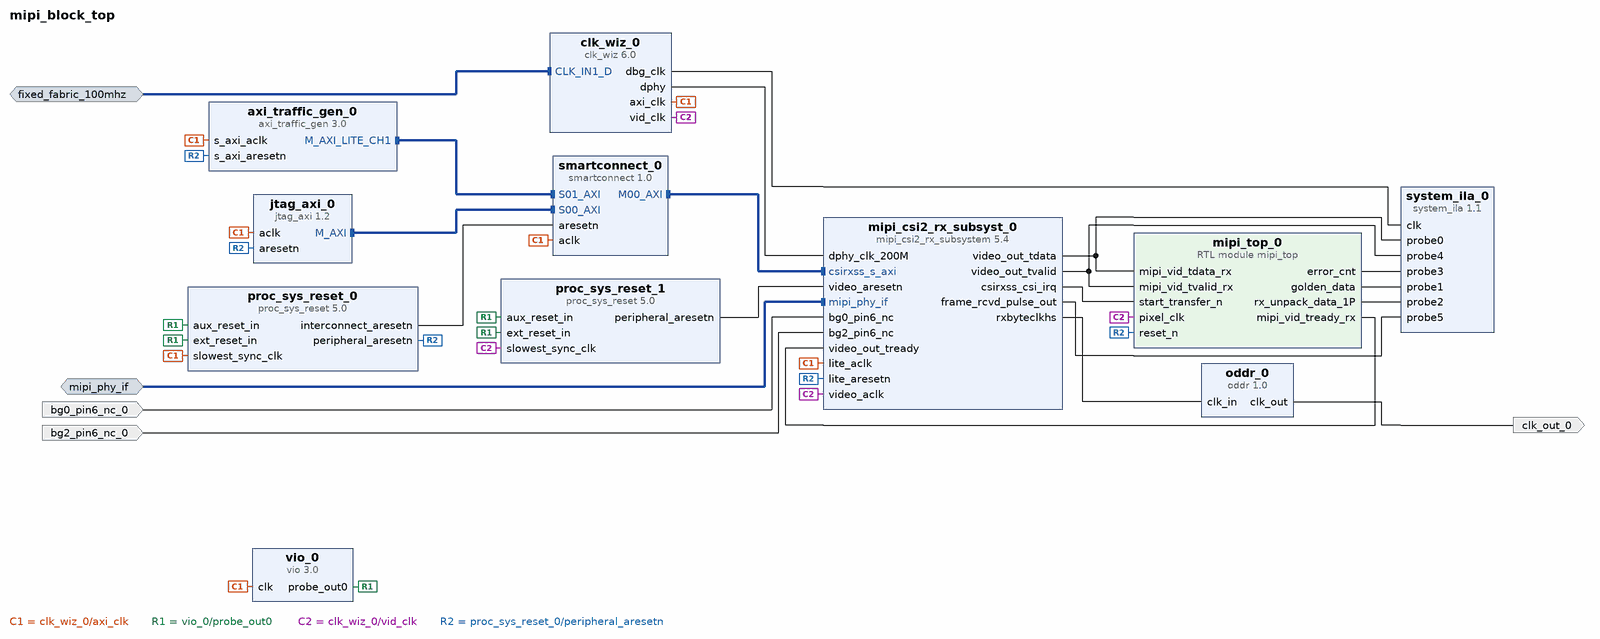
[diagram p0: block diagram of the top level]
# Vivado block design mipi_block_top, xcau25p-ffvb676-2-e, Vivado 2023.2_AR000035847
create_bd_design mipi_block_top

create_bd_intf_port -mode Slave -vlnv xilinx.com:interface:diff_clock_rtl:1.0 fixed_fabric_100mhz
set_property -dict {CONFIG.FREQ_HZ 100000000} [get_bd_intf_ports fixed_fabric_100mhz]
create_bd_intf_port -mode Slave -vlnv xilinx.com:interface:mipi_phy_rtl:1.0 mipi_phy_if
create_bd_port -dir I bg0_pin6_nc_0
create_bd_port -dir I bg2_pin6_nc_0
create_bd_port -dir O -type clk clk_out_0

create_bd_cell -type ip -vlnv xilinx.com:ip:clk_wiz:6.0 clk_wiz_0
set_property -dict [list \
  CONFIG.CLKOUT1_JITTER 85.182 \
  CONFIG.CLKOUT1_PHASE_ERROR 76.967 \
  CONFIG.CLKOUT1_REQUESTED_OUT_FREQ 200 \
  CONFIG.CLKOUT2_JITTER 79.341 \
  CONFIG.CLKOUT2_PHASE_ERROR 76.967 \
  CONFIG.CLKOUT2_REQUESTED_OUT_FREQ 300 \
  CONFIG.CLKOUT2_USED true \
  CONFIG.CLKOUT3_JITTER 72.605 \
  CONFIG.CLKOUT3_PHASE_ERROR 76.967 \
  CONFIG.CLKOUT3_REQUESTED_OUT_FREQ 500 \
  CONFIG.CLKOUT3_USED true \
  CONFIG.CLKOUT4_JITTER 72.605 \
  CONFIG.CLKOUT4_PHASE_ERROR 76.967 \
  CONFIG.CLKOUT4_REQUESTED_OUT_FREQ 500 \
  CONFIG.CLKOUT4_USED true \
  CONFIG.CLK_IN1_BOARD_INTERFACE fixed_fabric_100mhz \
  CONFIG.CLK_OUT1_PORT dphy \
  CONFIG.CLK_OUT2_PORT axi_clk \
  CONFIG.CLK_OUT3_PORT vid_clk \
  CONFIG.CLK_OUT4_PORT dbg_clk \
  CONFIG.MMCM_CLKFBOUT_MULT_F 15.000 \
  CONFIG.MMCM_CLKIN1_PERIOD 10.000 \
  CONFIG.MMCM_CLKIN2_PERIOD 10.000 \
  CONFIG.MMCM_CLKOUT0_DIVIDE_F 7.500 \
  CONFIG.MMCM_CLKOUT1_DIVIDE 5 \
  CONFIG.MMCM_CLKOUT2_DIVIDE 3 \
  CONFIG.MMCM_CLKOUT3_DIVIDE 3 \
  CONFIG.NUM_OUT_CLKS 4 \
  CONFIG.PRIM_SOURCE Differential_clock_capable_pin \
  CONFIG.RESET_PORT reset \
  CONFIG.RESET_TYPE ACTIVE_HIGH \
  CONFIG.USE_BOARD_FLOW true \
  CONFIG.USE_LOCKED false \
  CONFIG.USE_RESET false \
] [get_bd_cells clk_wiz_0]
create_bd_cell -type ip -vlnv xilinx.com:ip:mipi_csi2_rx_subsystem:5.4 mipi_csi2_rx_subsyst_0
set_property -dict [list \
  CONFIG.CLK_LANE_IO_LOC F20 \
  CONFIG.CMN_INC_VFB true \
  CONFIG.CMN_NUM_LANES 4 \
  CONFIG.CMN_NUM_PIXELS 1 \
  CONFIG.CMN_PXL_FORMAT RGB888 \
  CONFIG.CSI_BUF_DEPTH 4096 \
  CONFIG.CSI_EMB_NON_IMG false \
  CONFIG.C_CLK_LANE_IO_POSITION 19 \
  CONFIG.C_CSI_EN_CRC true \
  CONFIG.C_CSI_FILTER_USERDATATYPE false \
  CONFIG.C_DATA_LANE0_IO_POSITION 13 \
  CONFIG.C_DATA_LANE1_IO_POSITION 26 \
  CONFIG.C_DATA_LANE2_IO_POSITION 2 \
  CONFIG.C_DATA_LANE3_IO_POSITION 15 \
  CONFIG.C_DPHY_LANES 4 \
  CONFIG.C_EN_BG0_PIN6 true \
  CONFIG.C_EN_BG2_PIN6 true \
  CONFIG.C_EN_CNTS_BYTE_CLK true \
  CONFIG.C_EN_CSI_V2_0 false \
  CONFIG.C_EN_TIMEOUT_REGS false \
  CONFIG.C_HS_SETTLE_NS 139 \
  CONFIG.C_RCVE_DESKEW_SEQ false \
  CONFIG.DATA_LANE0_IO_LOC H18 \
  CONFIG.DATA_LANE1_IO_LOC C18 \
  CONFIG.DATA_LANE2_IO_LOC H17 \
  CONFIG.DATA_LANE3_IO_LOC F18 \
  CONFIG.DPY_EN_REG_IF true \
  CONFIG.DPY_LINE_RATE 2500 \
  CONFIG.HP_IO_BANK_SELECTION 67 \
  CONFIG.SupportLevel 1 \
  CONFIG.VFB_TU_WIDTH 96 \
] [get_bd_cells mipi_csi2_rx_subsyst_0]
create_bd_cell -type ip -vlnv xilinx.com:ip:proc_sys_reset:5.0 proc_sys_reset_0
set_property -dict {CONFIG.C_EXT_RST_WIDTH 1} [get_bd_cells proc_sys_reset_0]
create_bd_cell -type ip -vlnv xilinx.com:ip:proc_sys_reset:5.0 proc_sys_reset_1
create_bd_cell -type ip -vlnv xilinx.com:ip:jtag_axi:1.2 jtag_axi_0
set_property -dict {CONFIG.PROTOCOL 2} [get_bd_cells jtag_axi_0]
create_bd_cell -type ip -vlnv xilinx.com:ip:axi_traffic_gen:3.0 axi_traffic_gen_0
set_property -dict [list \
  CONFIG.C_ATG_MIF_DATA_DEPTH 256 \
  CONFIG.C_ATG_MODE AXI4-Lite \
  CONFIG.C_ATG_SYSTEM_CH1_HIGH 0x44a2ffff \
  CONFIG.C_ATG_SYSTEM_CH1_LOW 0x44a00000 \
  CONFIG.C_ATG_SYSTEM_INIT_ADDR_MIF ../mipi_block_top_axi_traffic_gen_0_0.coe \
  CONFIG.C_ATG_SYSTEM_INIT_DATA_MIF ../mipi_block_top_axi_traffic_gen_data.coe \
  CONFIG.C_ATG_SYSTEM_TEST_MAX_CLKS 50000 \
] [get_bd_cells axi_traffic_gen_0]
create_bd_cell -type ip -vlnv xilinx.com:ip:smartconnect:1.0 smartconnect_0
set_property -dict {CONFIG.NUM_MI 1} [get_bd_cells smartconnect_0]
create_bd_cell -type ip -vlnv xilinx.com:ip:vio:3.0 vio_0
set_property -dict {CONFIG.C_NUM_PROBE_IN 0 CONFIG.C_PROBE_OUT0_INIT_VAL 0x1} [get_bd_cells vio_0]
create_bd_cell -type ip -vlnv xilinx.com:ip:system_ila:1.1 system_ila_0
set_property -dict [list \
  CONFIG.C_DATA_DEPTH 8192 \
  CONFIG.C_MON_TYPE NATIVE \
  CONFIG.C_NUM_OF_PROBES 6 \
  CONFIG.C_PROBE0_TYPE 0 \
  CONFIG.C_PROBE1_TYPE 0 \
  CONFIG.C_PROBE2_TYPE 0 \
  CONFIG.C_PROBE3_TYPE 0 \
  CONFIG.C_PROBE4_TYPE 0 \
  CONFIG.C_PROBE5_TYPE 0 \
  CONFIG.C_PROBE_WIDTH_PROPAGATION AUTO \
] [get_bd_cells system_ila_0]
create_bd_cell -type ip -vlnv xilinx.com:ip:oddr:1.0 oddr_0
create_bd_cell -type module -reference mipi_top mipi_top_0

# ---- connections ----

connect_bd_intf_net [get_bd_intf_pins axi_traffic_gen_0/M_AXI_LITE_CH1] [get_bd_intf_pins smartconnect_0/S01_AXI]
connect_bd_intf_net [get_bd_intf_ports fixed_fabric_100mhz] [get_bd_intf_pins clk_wiz_0/CLK_IN1_D]
connect_bd_intf_net [get_bd_intf_pins jtag_axi_0/M_AXI] [get_bd_intf_pins smartconnect_0/S00_AXI]
connect_bd_intf_net [get_bd_intf_pins mipi_csi2_rx_subsyst_0/mipi_phy_if] [get_bd_intf_ports mipi_phy_if]
connect_bd_intf_net [get_bd_intf_pins smartconnect_0/M00_AXI] [get_bd_intf_pins mipi_csi2_rx_subsyst_0/csirxss_s_axi]
connect_bd_net -net bg0_pin6_nc_0_1 [get_bd_ports bg0_pin6_nc_0] [get_bd_pins mipi_csi2_rx_subsyst_0/bg0_pin6_nc]
connect_bd_net -net bg2_pin6_nc_0_1 [get_bd_ports bg2_pin6_nc_0] [get_bd_pins mipi_csi2_rx_subsyst_0/bg2_pin6_nc]
connect_bd_net [get_bd_pins clk_wiz_0/axi_clk] \
  [get_bd_pins axi_traffic_gen_0/s_axi_aclk] [get_bd_pins jtag_axi_0/aclk] [get_bd_pins proc_sys_reset_0/slowest_sync_clk] \
  [get_bd_pins smartconnect_0/aclk] [get_bd_pins vio_0/clk] [get_bd_pins mipi_csi2_rx_subsyst_0/lite_aclk]
connect_bd_net [get_bd_pins clk_wiz_0/dbg_clk] [get_bd_pins system_ila_0/clk]
connect_bd_net [get_bd_pins clk_wiz_0/dphy] [get_bd_pins mipi_csi2_rx_subsyst_0/dphy_clk_200M]
connect_bd_net -net clk_wiz_0_locked [get_bd_pins vio_0/probe_out0] \
  [get_bd_pins proc_sys_reset_0/ext_reset_in] [get_bd_pins proc_sys_reset_0/aux_reset_in] \
  [get_bd_pins proc_sys_reset_1/ext_reset_in] [get_bd_pins proc_sys_reset_1/aux_reset_in]
connect_bd_net [get_bd_pins clk_wiz_0/vid_clk] \
  [get_bd_pins proc_sys_reset_1/slowest_sync_clk] [get_bd_pins mipi_top_0/pixel_clk] \
  [get_bd_pins mipi_csi2_rx_subsyst_0/video_aclk]
connect_bd_net -net error_cnt [get_bd_pins mipi_top_0/error_cnt] [get_bd_pins system_ila_0/probe3]
connect_bd_net -net golden_data [get_bd_pins mipi_top_0/golden_data] [get_bd_pins system_ila_0/probe1]
connect_bd_net [get_bd_pins mipi_csi2_rx_subsyst_0/csirxss_csi_irq] [get_bd_pins mipi_top_0/start_transfer_n]
connect_bd_net -net mipi_csi2_rx_subsyst_0_frame_rcvd_pulse_out [get_bd_pins mipi_csi2_rx_subsyst_0/frame_rcvd_pulse_out] \
  [get_bd_pins system_ila_0/probe5]
connect_bd_net [get_bd_pins mipi_csi2_rx_subsyst_0/rxbyteclkhs] [get_bd_pins oddr_0/clk_in]
connect_bd_net -net mipi_csi2_rx_subsyst_0_video_out_tdata1 [get_bd_pins mipi_csi2_rx_subsyst_0/video_out_tdata] \
  [get_bd_pins system_ila_0/probe0] [get_bd_pins mipi_top_0/mipi_vid_tdata_rx]
connect_bd_net -net mipi_csi2_rx_subsyst_0_video_out_tvalid [get_bd_pins mipi_csi2_rx_subsyst_0/video_out_tvalid] \
  [get_bd_pins mipi_top_0/mipi_vid_tvalid_rx] [get_bd_pins system_ila_0/probe4]
connect_bd_net [get_bd_pins mipi_top_0/mipi_vid_tready_rx] [get_bd_pins mipi_csi2_rx_subsyst_0/video_out_tready]
connect_bd_net -net mipi_top_0_rx_unpack_data [get_bd_pins mipi_top_0/rx_unpack_data_1P] [get_bd_pins system_ila_0/probe2]
connect_bd_net [get_bd_pins oddr_0/clk_out] [get_bd_ports clk_out_0]
connect_bd_net [get_bd_pins proc_sys_reset_0/interconnect_aresetn] [get_bd_pins smartconnect_0/aresetn]
connect_bd_net [get_bd_pins proc_sys_reset_1/peripheral_aresetn] [get_bd_pins mipi_csi2_rx_subsyst_0/video_aresetn]
connect_bd_net -net xlconstant_1_dout [get_bd_pins proc_sys_reset_0/peripheral_aresetn] \
  [get_bd_pins axi_traffic_gen_0/s_axi_aresetn] [get_bd_pins jtag_axi_0/aresetn] [get_bd_pins mipi_top_0/reset_n] \
  [get_bd_pins mipi_csi2_rx_subsyst_0/lite_aresetn]
set_property HDL_ATTRIBUTE.DEBUG true [get_bd_nets error_cnt]
set_property HDL_ATTRIBUTE.MARK_DEBUG true [get_bd_nets error_cnt]
set_property HDL_ATTRIBUTE.DEBUG true [get_bd_nets golden_data]
set_property HDL_ATTRIBUTE.MARK_DEBUG true [get_bd_nets golden_data]
set_property HDL_ATTRIBUTE.DEBUG true [get_bd_nets mipi_csi2_rx_subsyst_0_frame_rcvd_pulse_out]
set_property HDL_ATTRIBUTE.MARK_DEBUG true [get_bd_nets mipi_csi2_rx_subsyst_0_frame_rcvd_pulse_out]
set_property HDL_ATTRIBUTE.DEBUG true [get_bd_nets mipi_csi2_rx_subsyst_0_video_out_tdata1]
set_property HDL_ATTRIBUTE.MARK_DEBUG true [get_bd_nets mipi_csi2_rx_subsyst_0_video_out_tdata1]
set_property HDL_ATTRIBUTE.DEBUG true [get_bd_nets mipi_csi2_rx_subsyst_0_video_out_tvalid]
set_property HDL_ATTRIBUTE.MARK_DEBUG true [get_bd_nets mipi_csi2_rx_subsyst_0_video_out_tvalid]
set_property HDL_ATTRIBUTE.DEBUG true [get_bd_nets mipi_top_0_rx_unpack_data]
set_property HDL_ATTRIBUTE.MARK_DEBUG true [get_bd_nets mipi_top_0_rx_unpack_data]

# ---- address map ----
assign_bd_address -offset 0x44A20000 -range 64K -target_address_space [get_bd_addr_spaces axi_traffic_gen_0/Reg1] [get_bd_addr_segs mipi_csi2_rx_subsyst_0/csirxss_s_axi/Reg]
assign_bd_address -offset 0x44A20000 -range 64K -target_address_space [get_bd_addr_spaces jtag_axi_0/Data] [get_bd_addr_segs mipi_csi2_rx_subsyst_0/csirxss_s_axi/Reg]

validate_bd_design
save_bd_design
